# EAGLE schematic ATtiny4313_PN532_I2CMUX (EAGLE 6.5.0)
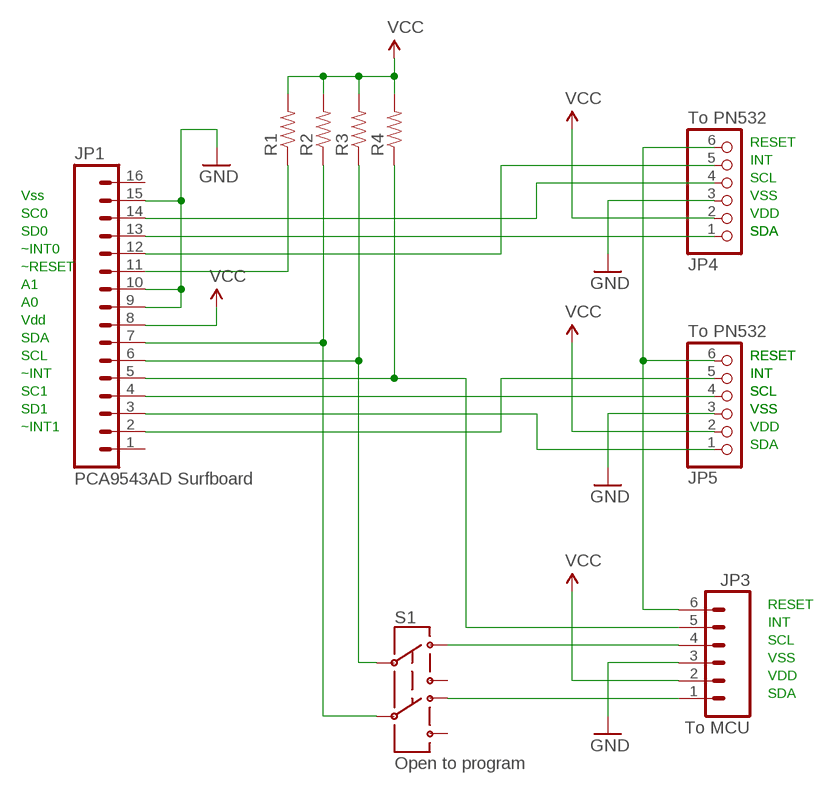
[diagram p0: schematic, sheet 1]

## Parts
JP1  PCA9543AD Surfboard  M16MACHIINE-PIN_LOCK  [1X16_MACHINE-PIN-HEADER_LOCK.004]
JP3  To MCU  M06LONGPADS  [1X06_LONGPADS]
JP4  To PN532  PINHD-1X6/90  [1X06/90]
JP5  To PN532  PINHD-1X6/90  [1X06/90]
R1  RESISTORAXIAL-0.3  [AXIAL-0.3]
R2  RESISTORAXIAL-0.3  [AXIAL-0.3]
R3  RESISTORAXIAL-0.3  [AXIAL-0.3]
R4  RESISTORAXIAL-0.3  [AXIAL-0.3]
S1  Open to program  SWITCH-DPDTOS  [OS]

## Nets
GND: JP1.9 JP1.10 JP1.15 JP3.3 JP4.3 JP5.3
N$1: JP1.4 JP5.4
N$2: JP1.14 JP4.4
N$3: JP1.13 JP4.1
N$4: JP1.3 JP5.1
N$5: JP1.5 JP3.5 R4.P$1
N$6: JP1.6 R3.P$1 S1.2
N$7: JP3.4 S1.1
N$8: JP3.1 S1.4
N$9: JP1.11 R1.P$1
N$10: JP1.12 JP4.5
N$11: JP1.2 JP5.5
N$12: JP3.6 JP4.6 JP5.6
N$18: JP1.7 R2.P$1 S1.5
VCC: JP1.8 JP3.2 JP4.2 JP5.2 R1.P$2 R2.P$2 R3.P$2 R4.P$2
Unconnected: JP1.1 JP1.16 S1.3 S1.6

## Notes on the sheet
- RESET
- INT
- SCL
- Vss | VSS
- SC0 | VDD
- SD0 | SDA | SDA
- ~INT0
- ~RESET
- A1
- A0
- Vdd
- SDA
- SCL | RESET | RESET
- ~INT | INT | INT
- SC1 | SCL | SCL
- SD1 | VSS | VSS
- ~INT1 | VDD
- SDA
- RESET
- INT
- SCL
- VSS
- VDD
- SDA

## Library data of the parts
JP1 = SparkFun-Connectors:M16: 1x16 .1" header
JP3 = SparkFun-Connectors:M06: Header 6 Standard 6-pin 0.1" header. Use with straight break away headers (SKU : PRT-00116), right angle break away headers (PRT-00553), swiss pins (PRT-00743), machine pins (PRT-00117), and female headers (PRT-00115). Molex polarized connector foot print use with SKU : PRT-08094 with associated crimp pins and housings. NOTES ON THE VARIANTS LOCK and LOCK_LONGPADS... This footprint was designed to help hold the alignment of a through-hole component (i.e. 6-pin header) while soldering it into place. You may notice that each hole has been shifted either up or down by 0.005 of an inch from it's more standard position (which is a perfectly straight line). This slight alteration caused the pins (the squares in the middle) to touch the edges of the holes. Because they are alternating, it causes a "brace" to hold the component in place. 0.005 has proven to be the perfect amount of "off-center" position when using our standard breakaway headers. Although looks a little odd when you look at the bare footprint, once you have a header in there, the alteration is very hard to notice. Also, if you push a header all the way into place, it is covered up entirely on the bottom side. This idea of altering the position of holes to aid alignment will be further integrated into the Sparkfun Library for other footprints. It can help hold any component with 3 or more connection pins.
JP4 JP5 = pinhead:PINHD-1X6: PIN HEADER
R1-R4 = SparkFun-Passives:RESISTOR: Resistor Basic schematic elements and footprints for 0603, 1206, and PTH resistors.
S1 = SparkFun-Electromechanical:SWITCH-DPDT: DPDT Version of the COM-00597